# Altium schematic sheet 0_电子天平.SchDoc: 电子天平
size A4; Date: 2020/01/07; ApprovedBy: Riggin; CheckedBy: Riggin; Author: Riggin; DrawnBy: Riggin; Engineer: Riggin; DocumentNumber: 1; Revision: V1.0; SheetNumber: 1; SheetTotal: 8; Time: 14:09:34; ProjectName: 电子天平
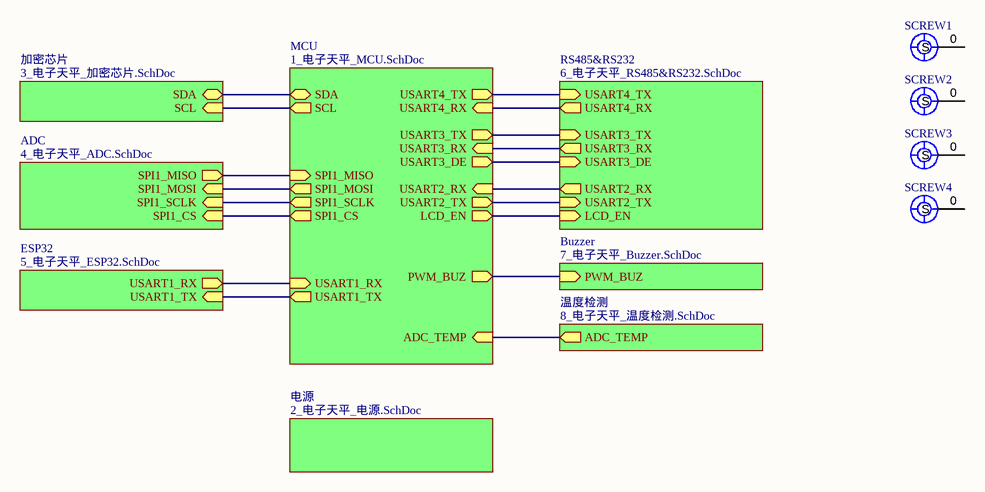
[diagram p0: 0_电子天平.SchDoc]

## Parts
SCREW1  (no value)  [SCREW_M3]
SCREW2  (no value)  [SCREW_M3]
SCREW3  (no value)  [SCREW_M3]
SCREW4  (no value)  [SCREW_M3]

## Sub-sheets
ADC = 4_电子天平_ADC.SchDoc: SPI1_SCLK (in), SPI1_MOSI (in), SPI1_CS (in), SPI1_MISO (out)
Buzzer = 7_电子天平_Buzzer.SchDoc: PWM_BUZ (in)
ESP32 = 5_电子天平_ESP32.SchDoc: USART1_TX (in), USART1_RX (out)
MCU = 1_电子天平_MCU.SchDoc: SDA (bidir), SCL (out), USART2_TX (out), USART2_RX (in), PWM_BUZ (out), USART4_TX (out), USART4_RX (in), LCD_EN (out), USART3_RX (in), USART3_TX (out), USART3_DE (out), SPI1_SCLK (out), SPI1_MOSI (out), SPI1_CS (out), SPI1_MISO (in), USART1_TX (out), USART1_RX (in), ADC_TEMP (in)
RS485&RS232 = 6_电子天平_RS485&RS232.SchDoc: USART4_TX (in), USART4_RX (out), LCD_EN (in), USART3_RX (out), USART3_TX (in), USART3_DE (in), USART2_TX (in), USART2_RX (out)
加密芯片 = 3_电子天平_加密芯片.SchDoc: SDA (bidir), SCL (in)
温度检测 = 8_电子天平_温度检测.SchDoc: ADC_TEMP (out)
电源 = 2_电子天平_电源.SchDoc: no entries

## Nets
(unnamed): sheet MCU/SDA, sheet 加密芯片/SDA
(unnamed): sheet MCU/SCL, sheet 加密芯片/SCL
(unnamed): sheet MCU/USART2_TX, sheet RS485&RS232/USART2_TX
(unnamed): sheet MCU/USART2_RX, sheet RS485&RS232/USART2_RX
(unnamed): sheet MCU/PWM_BUZ, sheet Buzzer/PWM_BUZ
(unnamed): sheet MCU/USART4_TX, sheet RS485&RS232/USART4_TX
(unnamed): sheet MCU/USART4_RX, sheet RS485&RS232/USART4_RX
(unnamed): sheet MCU/LCD_EN, sheet RS485&RS232/LCD_EN
(unnamed): sheet MCU/USART3_RX, sheet RS485&RS232/USART3_RX
(unnamed): sheet MCU/USART3_TX, sheet RS485&RS232/USART3_TX
(unnamed): sheet MCU/USART3_DE, sheet RS485&RS232/USART3_DE
(unnamed): sheet MCU/SPI1_SCLK, sheet ADC/SPI1_SCLK
(unnamed): sheet MCU/SPI1_MOSI, sheet ADC/SPI1_MOSI
(unnamed): sheet MCU/SPI1_CS, sheet ADC/SPI1_CS
(unnamed): sheet MCU/SPI1_MISO, sheet ADC/SPI1_MISO
(unnamed): sheet MCU/USART1_TX, sheet ESP32/USART1_TX
(unnamed): sheet MCU/USART1_RX, sheet ESP32/USART1_RX
(unnamed): sheet MCU/ADC_TEMP, sheet 温度检测/ADC_TEMP

Not connected (* = marked no-connect by the designer): SCREW1 0(S); SCREW2 0(S); SCREW3 0(S); SCREW4 0(S)

## Notes on the sheet
- Title
- Company:
- Address:
- 广东省广州市
- DZT Studio
- Size:
- Date:
- Drawn By:
- A4
- Riggin
- Time:
- Revision:
- Approved By:
- Sheet
- of
- Email:
- RigginLi@icloud.com
- Project:

## Library data of the parts
SCREW1-SCREW4 = SCREW: M3 螺丝孔/定位孔